# Altium schematic sheet Power.SchDoc: Power
size A4; Project: STM32H7-DK; Date: Not used; ApprovedBy: Not used; CheckedBy: Not used; Author: Not used; CompanyName: STMicroelectronics; DrawnBy: Not used; Engineer: Not used; Organization: Not used; Address1: Not used; Address2: Not used; Address3: Not used; Address4: Not used; DocumentNumber: Not used; Revision: Not used; SheetNumber: 4; SheetTotal: 16; CurrentTime: Not used; CurrentDate: Not used; Time: Not used; DocumentFullPathAndName: Not used; DocumentName: Not used; ModifiedDate: Not used; ImagePath: Not used; ProjectName: Not used; Application_BuildNumber: Not used
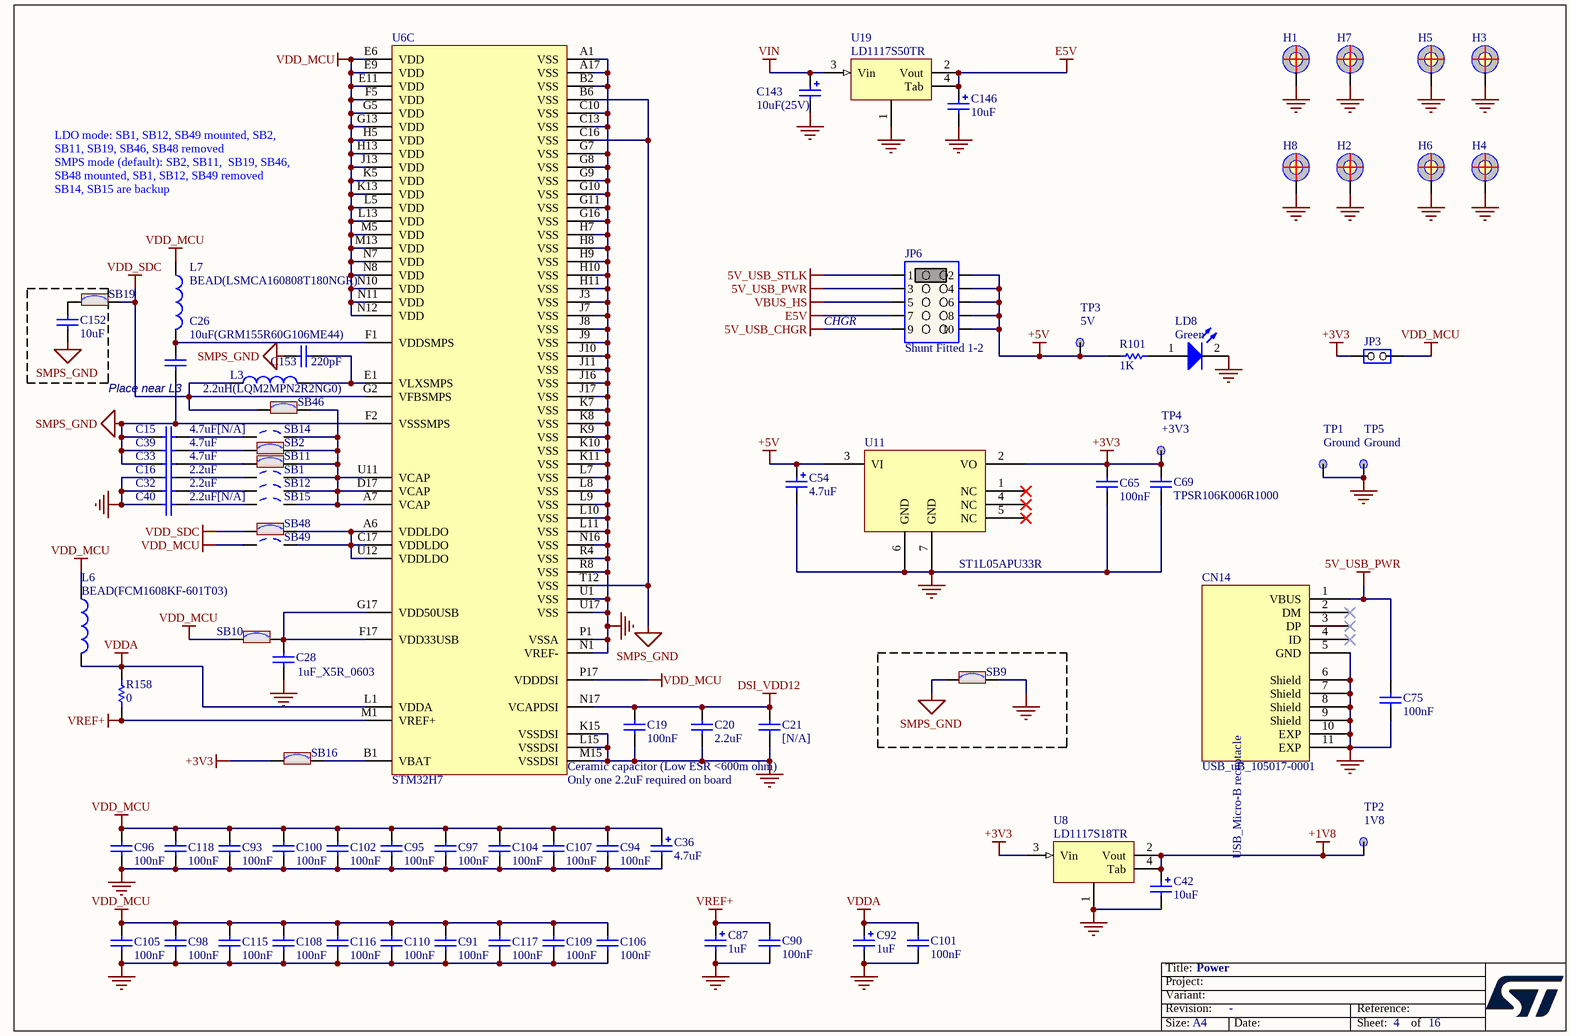
[diagram p0: Power.SchDoc]

## Parts
C15  4.7uF[N/A]  [0402C]
C16  2.2uF  [0603C]
C19  100nF  [0402C]
C20  2.2uF  [0603C]
C21  [N/A]  [1206C]
C26  10uF(GRM155R60G106ME44)  [0402C]
C28  1uF_X5R_0603  [0603C]
C32  2.2uF  [0603C]
C33  4.7uF  [0402C]
C36  4.7uF  [TAN-A]
C39  4.7uF  [0402C]
C40  2.2uF[N/A]  [0603C]
C42  10uF  [TAN-A]
C54  4.7uF  [TAN-A]
C65  100nF  [0603C]
C69  TPSR106K006R1000  [0805C]
C75  100nF  [0402C]
C87  1uF  [TAN-A]
C90  100nF  [0402C]
C91  100nF  [0402C]
C92  1uF  [TAN-A]
C93  100nF  [0402C]
C94  100nF  [0402C]
C95  100nF  [0402C]
C96  100nF  [0402C]
C97  100nF  [0402C]
C98  100nF  [0402C]
C100  100nF  [0402C]
C101  100nF  [0402C]
C102  100nF  [0402C]
C104  100nF  [0402C]
C105  100nF  [0402C]
C106  100nF  [0402C]
C107  100nF  [0402C]
C108  100nF  [0402C]
C109  100nF  [0402C]
C110  100nF  [0402C]
C115  100nF  [0402C]
C116  100nF  [0402C]
C117  100nF  [0402C]
C118  100nF  [0402C]
C143  10uF(25V)  [TAN-B]
C146  10uF  [TAN-A]
C152  10uF  [0603C]
C153  220pF  [0402C]
CN14  value USB_uB_105017-0001  [MICRO_USB_B_105017]  (hidden comment: USB_uB_105017.0001)
H1  POSITION HOLE C6D3R5  [HOLE_C7D3R5]  (value not drawn)
H2  POSITION HOLE C6D3R5  [HOLE_C7D3R5]  (value not drawn)
H3  POSITION HOLE C6D3R5  [HOLE_C9D4R5]  (value not drawn)
H4  POSITION HOLE C6D3R5  [HOLE_C9D4R5]  (value not drawn)
H5  POSITION HOLE C6D3R5  [HOLE_C9D4R5]  (value not drawn)
H6  POSITION HOLE C6D3R5  [HOLE_C9D4R5]  (value not drawn)
H7  POSITION HOLE C6D3R5  [HOLE_C7D3R5]  (value not drawn)
H8  POSITION HOLE C6D3R5  [HOLE_C7D3R5]  (value not drawn)
JP3  (no value)  [SIP2]
JP6  value Shunt Fitted 1-2  [HDR_2X5_2R54]  (hidden comment: Jumper_Header 5x2 Fitted 1-2)
L3  2.2uH(LQM2MPN2R2NG0)  [LSM2_VLS2016E_S]
L6  BEAD(FCM1608KF-601T03)  [0603L]
L7  BEAD(LSMCA160808T180NGR)  [0603L]
LD8  Green  [0603D]
R101  1K  [0603R]
R158  0  [0603R]
SB1  Solder Bridge OFF  [SB_0603]  (value not drawn)
SB2  Solder Bridge ON  [SB_0603]  (value not drawn)
SB9  Solder Bridge ON  [SB_0603]  (value not drawn)
SB10  Solder Bridge ON  [SB_0603]  (value not drawn)
SB11  Solder Bridge ON  [SB_0603]  (value not drawn)
SB12  Solder Bridge OFF  [SB_0603]  (value not drawn)
SB14  Solder Bridge OFF  [SB_0603]  (value not drawn)
SB15  Solder Bridge OFF  [SB_0603]  (value not drawn)
SB16  Solder Bridge ON  [SB_0603]  (value not drawn)
SB19  Solder Bridge ON  [SB_0603]  (value not drawn)
SB46  Solder Bridge ON  [SB_0603]  (value not drawn)
SB48  Solder Bridge ON  [SB_0603]  (value not drawn)
SB49  Solder Bridge OFF  [SB_0603]  (value not drawn)
TP1  Ground  [TP_C40]
TP2  1V8  [TP_C40]
TP3  5V  [TP_C40]
TP4  +3V3  [TP_C40]
TP5  Ground  [TP_C40]
U6  STM32H7  [BGA265_0R8_14X14_SKT]  (part C of 3)
U8  LD1117S18TR  [SOT-223]
U11  ST1L05APU33R  [DFN6_0R95_3X3]
U19  LD1117S50TR  [SOT-223]

## Nets
5V_USB_CHGR: JP6.9
5V_USB_PWR: C75.2 CN14.1(VBUS) JP6.3
5V_USB_STLK: JP6.1
+1V8: C42.1 TP2.1 U8.2(Vout) U8.4(Tab)
+3V3: C65.1 C69.2 JP3.1(COMMON) SB16.1 TP4.1 U8.3(Vin) U11.2(VO)
+5V: C54.1 JP6.2 JP6.4 JP6.6 JP6.8 JP6.10 R101.2 TP3.1 U11.3(VI)
DSI_VDD12: C19.1 C20.1 C21.2 U6.N17(VCAPDSI)
E5V: C146.1 JP6.7 U19.2(Vout) U19.4(Tab)
GND: C16.1 C19.2 C20.2 C21.1 C28.1 C32.1 C36.2 C40.1 C42.2 C54.2 C65.2 C69.1 C75.1 C87.2 C90.1 C91.2 C92.2 C93.2 C94.2 C95.2 C96.2 C97.2 C98.2 C100.2 C101.1 C102.2 C104.2 C105.2 C106.2 C107.2 C108.2 C109.2 C110.2 C115.2 C116.2 C117.2 C118.2 C143.2 C146.2 CN14.5(GND) CN14.6(Shield) CN14.7(Shield) CN14.8(Shield) CN14.9(Shield) CN14.10(EXP) CN14.11(EXP) H1.1 H2.1 H3.1 H4.1 H5.1 H6.1 H7.1 H8.1 LD8.2(K) SB9.2 TP1.1 TP5.1 U6.A1(VSS) U6.A17(VSS) U6.B2(VSS) U6.C10(VSS) U6.C13(VSS) U6.G7(VSS) U6.G8(VSS) U6.G9(VSS) U6.G10(VSS) U6.G11(VSS) U6.G16(VSS) U6.H7(VSS) U6.H8(VSS) U6.H9(VSS) U6.H10(VSS) U6.H11(VSS) U6.J3(VSS) U6.J7(VSS) U6.J8(VSS) U6.J9(VSS) U6.J10(VSS) U6.J11(VSS) U6.J16(VSS) U6.J17(VSS) U6.K7(VSS) U6.K8(VSS) U6.K9(VSS) U6.K10(VSS) U6.K11(VSS) U6.K15(VSSDSI) U6.L7(VSS) U6.L8(VSS) U6.L9(VSS) U6.L10(VSS) U6.L11(VSS) U6.L15(VSSDSI) U6.M15(VSSDSI) U6.N1(VREF-) U6.N16(VSS) U6.P1(VSSA) U6.R4(VSS) U6.R8(VSS) U6.U1(VSS) U6.U17(VSS) U8.1 U11.6(GND) U11.7(GND) U19.1
SMPS_GND: C15.1 C26.1 C33.1 C39.1 C152.1 C153.2 SB9.1 U6.B6(VSS) U6.C16(VSS) U6.F2(VSSSMPS) U6.T12(VSS)
VBUS_HS: JP6.5
VDD_MCU: C36.1 C91.1 C93.1 C94.1 C95.1 C96.1 C97.1 C98.1 C100.1 C102.1 C104.1 C105.1 C106.1 C107.1 C108.1 C109.1 C110.1 C115.1 C116.1 C117.1 C118.1 JP3.2(NO) L6.1 L7.1 SB10.1 SB49.1 U6.E6(VDD) U6.E9(VDD) U6.E11(VDD) U6.F5(VDD) U6.G5(VDD) U6.G13(VDD) U6.H5(VDD) U6.H13(VDD) U6.J13(VDD) U6.K5(VDD) U6.K13(VDD) U6.L5(VDD) U6.L13(VDD) U6.M5(VDD) U6.M13(VDD) U6.N7(VDD) U6.N8(VDD) U6.N10(VDD) U6.N11(VDD) U6.N12(VDD) U6.P17(VDDDSI)
VDD_SDC: L3.1 SB19.2 SB46.1 SB48.1 U6.G2(VFBSMPS)
VDDA: C92.1 C101.2 L6.2 R158.1 U6.L1(VDDA)
VIN: C143.1 U19.3(Vin)
VREF+: C87.1 C90.2 R158.2 U6.M1(VREF+)
NetC15_2: C15.2 SB14.1
NetC16_2: C16.2 SB1.1
NetC26_2: C26.2 L7.2 U6.F1(VDDSMPS)
NetC28_2: C28.2 SB10.2 U6.F17(VDD33USB) U6.G17(VDD50USB)
NetC32_2: C32.2 SB12.1
NetC33_2: C33.2 SB11.1
NetC39_2: C39.2 SB2.1
NetC40_2: C40.2 SB15.1
NetC152_2: C152.2 SB19.1
NetC153_1: C153.1 L3.2 U6.E1(VLXSMPS)
NetLD8_1: LD8.1(A) R101.1
NetSB1_2: SB1.2 SB2.2 SB11.2 SB12.2 SB14.2 SB15.2 SB46.2 U6.A7(VCAP) U6.D17(VCAP) U6.U11(VCAP)
NetSB16_2: SB16.2 U6.B1(VBAT)
NetSB48_2: SB48.2 SB49.2 U6.A6(VDDLDO) U6.C17(VDDLDO) U6.U12(VDDLDO)

Not connected (* = marked no-connect by the designer): CN14 2(DM)* 3(DP)* 4(ID)*; U11 1(NC)* 4(NC)* 5(NC)*

## Notes on the sheet
- LDO mode: SB1, SB12, SB49 mounted, SB2, SB11, SB19, SB46, SB48 removed
  SMPS mode (default): SB2, SB11,  SB19, SB46, SB48 mounted, SB1, SB12, SB49 removed
  SB14, SB15 are backup
- CHGR
- Place near L3
- (near U6) Ceramic capacitor (Low ESR <600m ohm)
- (near U6) Only one 2.2uF required on board
- Title:
- Project:
- Size:
- Revision:
- Variant:
- A4
- -
- Date:
- Reference:
- Sheet:
- of
- (in symbol MCD-00028) USB_Micro-B receptacle

## Library data of the parts
C15 = cap: Capacitor; Value: 100nF; Ordered by: Subcon; ECCN_US/EU: NA; Fitted: NO; Published: 8-Jun-2000; Revision: July-2002: Re-released for DXP Platform.; Publisher: Altium Limited
C16 C26 C32 C33 C39 C90 C101 C152 C153 = Cap: Capacitor; Value: 10nF; Published: 8-Jun-2000; Revision: July-2002: Re-released for DXP Platform.; Publisher: Altium Limited
C19 C91 C93-C98 C100 C102 C104-C110 C115-C118 = CAP: Capacitor; Published: 8-Jun-2000; Revision: July-2002: Re-released for DXP Platform.; Publisher: Altium Limited; Value: 100nF
C20 = CAP: Capacitor; Value: 100nF; Published: 8-Jun-2000; Revision: July-2002: Re-released for DXP Platform.; Publisher: Altium Limited
C21 = cap: Capacitor; Value: 2.2uF; Ordered by: Subcon; ECCN_US/EU: NA; Fitted: NO; Published: 8-Jun-2000; Revision: July-2002: Re-released for DXP Platform.; Publisher: Altium Limited
C28 = CAP SMD 0603  X5R 1礔 25V 10%: 0603  X5R 1礔; Rated voltage: 25V; Tolerance: 10%; Manufacturer: *; Manufacturer P/N: *; Order code Farnell: 1288202RL; Value: 1礔; Power: *; Technology: X5R; Temperature  Factor: *; Temperature Max: +125癈; Temperature Min: -55癈; STS Code: *
C36 = Cap Pol1: Polarized Capacitor (Radial); Value: 47uF; Published: 8-Jun-2000; Revision: July-2002: Re-released for DXP Platform.; Publisher: Altium Limited
C40 = Cap: Capacitor; Value: 10nF; Fitted: NO; Published: 8-Jun-2000; Revision: July-2002: Re-released for DXP Platform.; Publisher: Altium Limited
C42 C146 = Cap_10uF_POL_10%_TANA: Polarized Capacitor,10uF,10V,10%,typeA,VISHAY; Manuf_Part_1: 293D106X9010A2TE3; Revision: July-2002: Re-released for DXP Platform.; Value: 10uF; Manuf_1: VISHAY; Order: *; ECCN_US/EU: n/a
C54 = Cap Pol1: Polarized Capacitor (Radial); Value: 100pF; Ordered by: Subcon; ECCN_US/EU: NA; Published: 8-Jun-2000; Revision: July-2002: Re-released for DXP Platform.; Publisher: Altium Limited
C65 = Cap: Capacitor; Value: 10nF; Ordered by: Subcon; ECCN_US/EU: NA; Published: 8-Jun-2000; Revision: July-2002: Re-released for DXP Platform.; Publisher: Altium Limited
C69 = Cap: Capacitor; Manuf_1: AVX; Ordered by: Subcon; ECCN_US/EU: NA; Revision: V1.0; Manuf_Part_1: TPSR106K006R1000; Value: TPSR106K006R1000
C75 = MCD-00016: Capacitor,20pF,50V,NPO,5%,0402; Manufacturer_Part_Number: CC0402JRNPO9BN200; Manufacturer: YAGEO; Provided_By: Subcon; Initial_Board_Reference: mb1274; Internal_Part_Number: MCD-00016; Value: 100nF; Status: Released; Package: 0402; ComponentLink1Description: Yageo_Capacitor_NP0_16V-to-50V.pdf; ECCN_US: n/a; ECCN_EU: n/a; Part_Type: Capacitor
C87 C92 = Cap Pol1: Polarized Capacitor (Radial); Value: 10uF; Published: 8-Jun-2000; Revision: July-2002: Re-released for DXP Platform.; Publisher: Altium Limited
C143 = Cap Pol1: Polarized Capacitor (Radial); Published: 8-Jun-2000; Revision: July-2002: Re-released for DXP Platform.; Publisher: Altium Limited; Value: 10uF
CN14 = MCD-00028: USB-MICRO-B, 0.65mm, RA, SMT, Bottom Mount,; Manufacturer_Part_Number: 1050170001; Manufacturer: MOLEX; Part_Type: Connector; Provided_By: Subcon; Initial_Board_Reference: mb1274; Internal_Part_Number: MCD-00028; Status: Released; ComponentLink1Description: Molex_Connector-USB-uB_1050170001.pdf; ECCN_US: n/a; ECCN_EU: n/a
H1-H8 = POSITION HOLE C6D3R5: Fitted: NO
JP3 = JP2
JP6 = MCD-01203: Header, 5x2, 2,54mm, VR, TH, Height 5.84mm/2.54mm - Shunt Fitted 1-2; Part_Type: Connector; Manufacturer_Part_Number: TSW-105-07-x-D; Manufacturer: SAMTEC; Provided_By: Subcon; Initial_Board_Reference: Mb1372; Internal_Part_Number: MCD-01203; Status: Symbol available; ComponentLink1Description: Samtec_TSW-HTSW-series.pdf; ComponentLink1URL: http://tunmcdsvn.tun.st.com/Component_Datasheet_Library/Trunk/Connectors/Samtec_TSW-HTSW-series; ECCN_US: n/a; ECCN_EU: n/a
L3 L6 L7 = Inductor: Value: 100uH; Published: 8-Jun-2000; Revision: July-2002: Re-released for DXP Platform.; Publisher: Altium Limited
  L7: MPN: LSMCA160808T180NGR
LD8 = LED2: Typical RED, GREEN, YELLOW, AMBER GaAs LED; Published: 8-Jun-2000; Revision: July-2002: Re-released for DXP Platform.; Publisher: Altium Limited
R101 = res1: Resistor; Published: 8-Jun-2000; Revision: July-2002: Re-released for DXP Platform.; Publisher: Altium Limited; Value: 1K
R158 = Res1: Resistor; Value: 1K; Published: 8-Jun-2000; Revision: July-2002: Re-released for DXP Platform.; Publisher: Altium Limited
SB1 SB12 SB14 SB15 SB49 = SB_OFF: Fitted: NO; Ordered by: Subcon; Revision: July-2002: Re-released for DXP Platform.; ECCN_US/EU: n/a
SB2 SB9-SB11 SB16 SB19 SB46 SB48 = SB_ON: Fitted: YES; Ordered by: Subcon; Revision: July-2002: Re-released for DXP Platform.; ECCN_US/EU: n/a
TP1-TP5 = TP
U6 = STM32H7_TFBGA265
U8 U19 = LD1117: Ordered by: STM; ECCN_US/EU: EAR99/NEC; Fitted: YES; Manuf_1: STM
  U8: Manuf_Part_1: LD1117S18TR
  U19: Manuf_Part_1: LD1117S50TR
U11 = ST1L05A: Ordered by: STM; ECCN_US/EU: EAR99/NEC; Fitted: YES; Manuf_1: STM; Manuf_Part_1: ST1L05APU33R